# Altium schematic sheet Interface.SchDoc
size A4; SheetNumber: 8; SheetTotal: 11
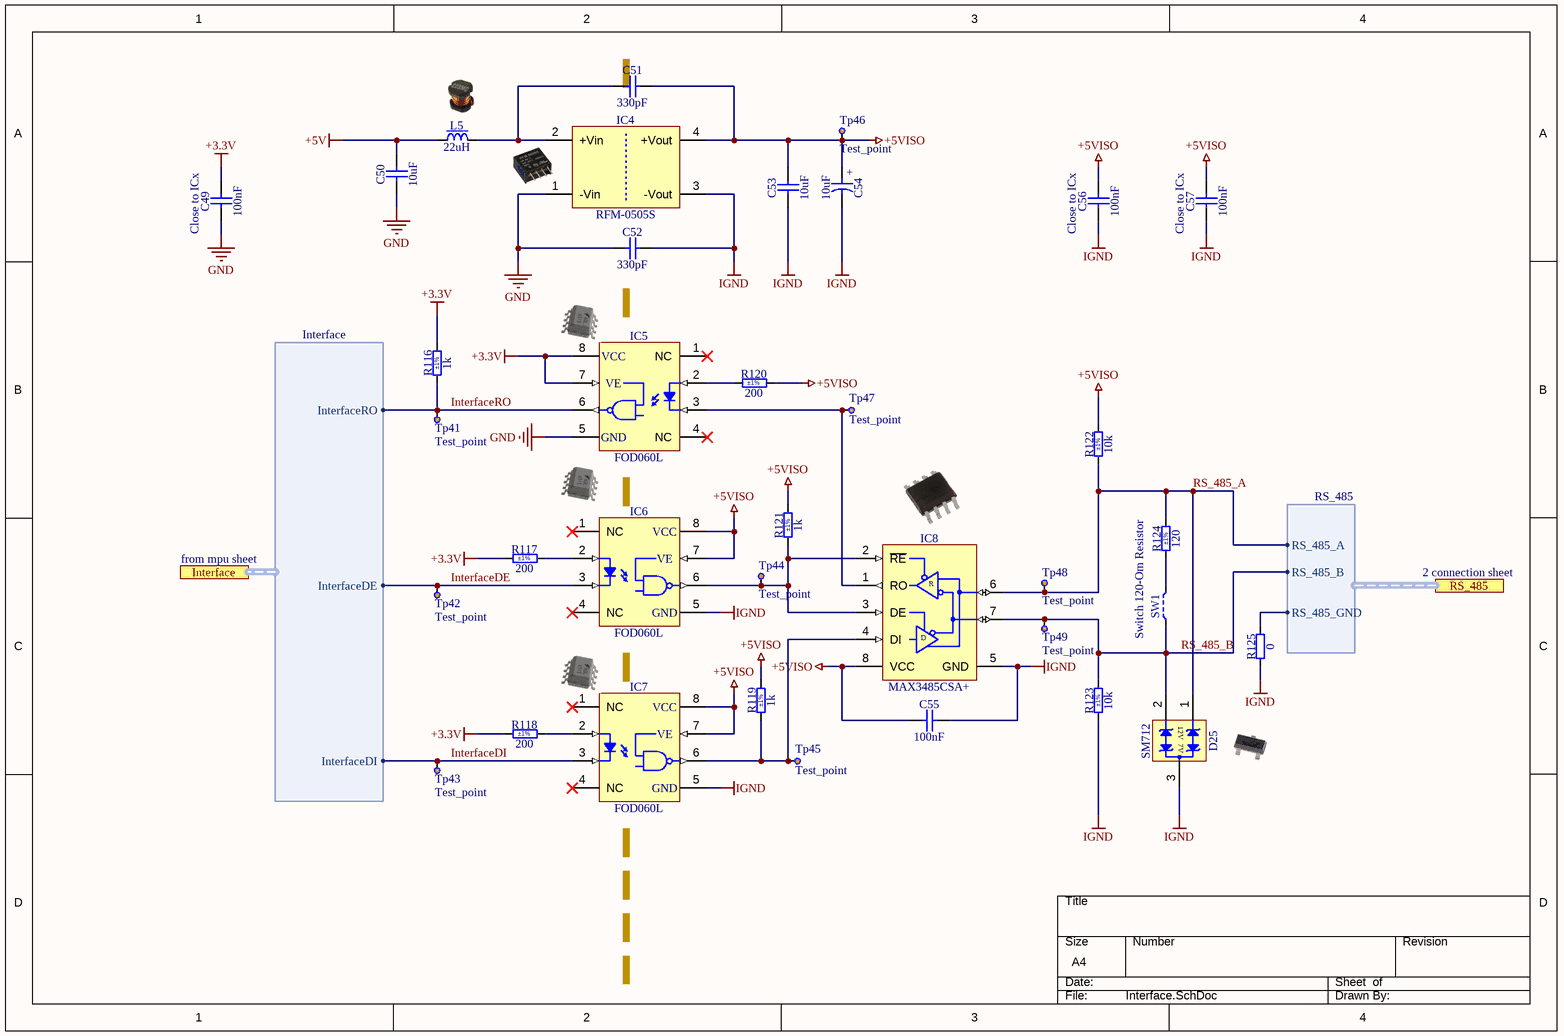
[diagram p0: Interface.SchDoc]

## Parts
C49  100nF  [CAPC1608X87N]
C50  10uF  [CAPC3216X140N]
C51  330pF  [CAPC4620X220N]
C52  330pF  [CAPC4620X220N]
C53  10uF  [CAPC3216X140N]
C54  10uF  [CAPAE430X540N]
C55  100nF  [CAPC1608X87N]
C56  100nF  [CAPC1608X87N]
C57  100nF  [CAPC1608X87N]
D25  SM712  [SOT95P237X112-3N]
IC4  RFM-0505S  [DCDC_RECOM_RFM]
IC5  FOD060L  [SOIC127P594X363-8N]
IC6  FOD060L  [SOIC127P594X363-8N]
IC7  FOD060L  [SOIC127P594X363-8N]
IC8  MAX3485CSA+  [SOIC127P600X175-8N]
L5  22uH  [IND_MURATA-PS_8200]
R116  1k  Tolerance: ±1%  [RESC1608X55N]
R117  200  Tolerance: ±1%  [RESC1608X55N]
R118  200  Tolerance: ±1%  [RESC1608X55N]
R119  1k  Tolerance: ±1%  [RESC1608X55N]
R120  200  Tolerance: ±1%  [RESC1608X55N]
R121  1k  Tolerance: ±1%  [RESC1608X55N]
R122  10k  Tolerance: ±1%  [RESC1608X55N]
R123  10k  Tolerance: ±1%  [RESC1608X55N]
R124  120  Tolerance: ±1%  [RESC3216X65N]
R125  0  [RESC1608X55N]
SW1  Switch  [JUMPSMD0805_G50]  (value not drawn)  (no BOM)
Tp41  Test_point  [TP_C40]
Tp42  Test_point  [TP_C40]
Tp43  Test_point  [TP_C40]
Tp44  Test_point  [TP_C40]
Tp45  Test_point  [TP_C40]
Tp46  Test_point  [TP_C40]
Tp47  Test_point  [TP_C40]
Tp48  Test_point  [TP_C40]
Tp49  Test_point  [TP_C40]

## Ports
Interface (harness Interface), RS_485 (harness RS_485)

## Harnesses
RS_485: RS_485_A, RS_485_B, RS_485_GND
Interface: InterfaceRO, InterfaceDE, InterfaceDI

## Nets
+3.3V: C49.2 IC5.7(VE) IC5.8(VCC) R116.2 R117.1 R118.1
+5V: C50.2 L5.1
+5VISO: C51.2 C53.2 C54.1 C55.1 C56.2 C57.2 IC4.4(+Vout) IC6.7(VE) IC6.8(VCC) IC7.7(VE) IC7.8(VCC) IC8.8(VCC) R119.2 R120.2 R121.2 R122.2 Tp46.1
GND: C49.1 C50.1 C52.1 IC4.1(-Vin) IC5.5(GND)
IGND: C52.2 C53.1 C54.2 C55.2 C56.1 C57.1 D25.3(GND) IC4.3(-Vout) IC6.5(GND) IC7.5(GND) IC8.5(GND) R123.1 R125.1
InterfaceDE: IC6.3(K) Tp42.1 ; port Interface.InterfaceDE
InterfaceDI: IC7.3(K) Tp43.1 ; port Interface.InterfaceDI
InterfaceRO: IC5.6(VO) R116.1 Tp41.1 ; port Interface.InterfaceRO
RS_485_A: D25.1(I/O1) IC8.6(A) R122.1 R124.2 Tp48.1 ; port RS_485.RS_485_A
RS_485_B: D25.2(I/O2) IC8.7(B) R123.2 SW1.1 Tp49.1 ; port RS_485.RS_485_B
NetC51_1: C51.1 IC4.2(+Vin) L5.2
NetIC5_2: IC5.2(A) R120.1
NetIC5_3: IC5.3(K) IC8.1(RO) Tp47.1
NetIC6_2: IC6.2(A) R117.2
NetIC6_6: IC6.6(VO) IC8.2(~{RE}) IC8.3(DE) R121.1 Tp44.1
NetIC7_2: IC7.2(A) R118.2
NetIC7_6: IC7.6(VO) IC8.4(DI) R119.1 Tp45.1
NetR124_1: R124.1 SW1.2
NetR125_2: R125.2 ; port RS_485.RS_485_GND

Not connected (* = marked no-connect by the designer): IC5 1(NC)* 4(NC)*; IC6 1(NC)* 4(NC)*; IC7 1(NC)* 4(NC)*

## Notes on the sheet
- (near C49) Close to ICx
- (near C56) Close to ICx
- (near C57) Close to ICx
- from mpu sheet
- 2 connection sheet
- Switch 120-Om Resistor
- THIS DOCUMENT AND THE DATA DISCLOSED HEREIN OR
- HEREWITH IS THE PROPERTY OF ALTIUM LIMITED AND MAY
- DWG NO:
- REVISION
- REV:
- DESCRIPTION
- DATE
- APPROVED
- BE FREELY DISTRIBUTED IN WHOLE. NO RIGHTS ARE
- RESERVED OR EXPRESS OR IMPLIED WARANTEE GIVEN.
- ENG:
- APPROVALS
- PROJECT
- DSN:
- CHK:
- REFERENCE DOCUMENTS
- PROJECT REVISION:
- TITLE
- DOCUMENT REVISION:
- DESIGN ITEM:
- BOM:
- FAB DWG:
- PCB DWG:
- ASSY DWG:
- SCALE:
- A3
- SIZE
- CAGE CODE
- FILE NAME
- DWG NO.
- SHEET
- OF
- REV
- (in symbol CAE430-540_10UF_16V_20%) +
- (in symbol MAX3485CSA+) R; D
- (in symbol SM712) 12V; 7V

## Library data of the parts
C49 C55-C57 = CC0603_100NF_50V_10%_X7R: Non-polarised capacitor; Part Description: SMD Multilayer Chip Ceramic Capacitor; Manufacturer: GENERIC; Manufacturer1 Part Number: 223858615649; Voltage: 50V; TC: X7R; Tolerance: ±10%; Part Number: CC0603_100NF_50V_10%_X7R; Component Kind: Standard; Component Type: Standard; Pin Count: 2; Value: 100nF; Status: Preferred; Manufacturer Part Number: CC0603_100NF_50V_10%_X7R; Case: 0603; Mounted: Yes; Socket: No; SMD: Yes; Sense: No; Manufacturer1 Example: PHYCOMP; Manufacturer1 ComponentHeight: 0.87mm; HelpURL: \\cern.ch\dfs\Applications\Altium\Datasheets\CC0603_X7R_PHYCOMP.pdf; Author: CERN DEM JLC; CreateDate: 03.12.2007; LatestRevisionDate: 03.12.2007
C50 C53 = CC1206_10UF_16V_10%_X7R: Non-polarised capacitor; Part Description: SMD Multilayer Chip Ceramic Capacitor; Manufacturer: GENERIC; Manufacturer1 Part Number: C1206C106K4RAC; Voltage: 16V; TC: X7R; Tolerance: ±10%; Part Number: CC1206_10UF_16V_10%_X7R; Component Kind: Standard; Component Type: Standard; Pin Count: 2; Value: 10uF; Status: Preferred; Manufacturer Part Number: CC1206_10UF_16V_10%_X7R; Case: 1206; Mounted: Yes; Socket: No; SMD: Yes; Sense: No; Manufacturer1 Example: KEMET; Manufacturer1 ComponentHeight: 1.8mm; HelpURL: \\cern.ch\dfs\Applications\Altium\Datasheets\CC1206_X7R_KEMET.pdf; Author: CERN DEM JLC; CreateDate: 28.04.2009; LatestRevisionDate: 28.04.2009
C51 C52 = CC1808_330PF_3KV_10%_X7R: Non-polarised capacitor; Part Description: High Voltage MLC Chip Capacitor; Manufacturer: GENERIC; Manufacturer1 Part Number: 1808HC331KAT1A; Voltage: 3kV; TC: X7R; Tolerance: ±10%; Part Number: CC1808_330PF_3KV_10%_X7R; Component Kind: Standard; Component Type: Standard; Pin Count: 2; Value: 330pF; Status: None; Manufacturer Part Number: CC1808_330PF_3KV_10%_X7R; Case: 1808; Mounted: Yes; Socket: No; SMD: Yes; Sense: No; Manufacturer1 Example: AVX; Manufacturer1 ComponentHeight: 2.20mm; HelpURL: \\cern.ch\dfs\Applications\Altium\Datasheets\CC1808_X7R_AVX_HV-MLC.pdf; Author: CERN DEM MR; CreateDate: 16.11.2017; LatestRevisionDate: 16.11.2017
C54 = CAE430-540_10UF_16V_20%: Polarised capacitor; Part Description: Aluminum Electrolytic SMT Capacitor; Manufacturer: PANASONIC; Manufacturer Part Number: EEEFK1C100AR; Voltage: 16V; Tolerance: ±20%; Part Number: CAE430-540_10UF_16V_20%; Component Kind: Standard; Component Type: Standard; Pin Count: 2; Value: 10uF; Status: Not Recommended; Case: B; Mounted: Yes; Socket: No; SMD: Yes; Sense: No; ComponentHeight: 5.8mm; HelpURL: \\cern.ch\dfs\Applications\Altium\Datasheets\CAE_PANASONIC_FK-V.pdf; Author: CERN DEM JLC; CreateDate: 03.12.2007; LatestRevisionDate: 05.11.2014
D25 = SM712: Asymmetrical TVS Diode for Extended Common-Mode RS-485; Manufacturer: SEMTECH; Voltage: 12V/-7V; Power: 400W; PressFit: No; Bonding: No; Part Number: SM712; Component Kind: Standard; Component Type: Standard; Device: SM712; PackageDescription: SOT, 0.95mm Pitch; 3 Pin, 1.30mm W X 2.92mm L X 1.12mm H body, IPC Medium Density; Status: Obsolete; Part Description: Asymmetrical TVS Diode for Extended Common-Mode RS-485; Manufacturer Part Number: SM712; Pin Count: 3; Case: SOT23-3; Mounted: Yes; Socket: No; SMD: Yes; Sense: No; ComponentHeight: 1.12mm; HelpURL: \\cern.ch\dfs\Applications\Altium\Datasheets\SM712.pdf; Author: CERN DEM JLC; CreateDate: 23.04.2012; LatestRevisionDate: 23.04.2012
IC4 = RFM-0505S: RECOM, RFM Serie, Single Output DCDC Converter; Part Description: 5V ±10% to 5V, Iout (max) 200mA, 1W DC-DC Converter; PressFit: No; Bonding: No; Part Number: RFM-0505S; Component Kind: Standard; Component Type: Standard; Device: RFM-0505S; PackageDescription: RFM Series, Body 11.5x6.00mm, SIP-4 Package; Manufacturer: RECOM; Manufacturer Part Number: RFM-0505S; Pin Count: 4; Mounted: Yes; Socket: No; SMD: No; Sense: No; ComponentHeight: 10.5mm; HelpURL: \\cern.ch\dfs\Applications\Altium\Datasheets\RFM-0505S.pdf; Author: CERN DEM BC; CreateDate: 16.07.2020; LatestRevisionDate: 16.07.2020
IC5-IC7 = FOD060L: Single Optocoupler; Part Description: LVTTL/LVCMOS 3.3V High Speed-10 MBit/s Logic Gate Optocoupler; Manufacturer: FAIRCHILD SEMICONDUCTOR; PressFit: No; Bonding: No; Part Number: FOD060L; Component Kind: Standard; Component Type: Standard; Device: FOD060L; PackageDescription: SOIC, 1.27mm Pitch; 8 Pin, 3.91mm W X 4.88mm L X 3.63mm H body, IPC Medium Density; Manufacturer Part Number: FOD060L; Pin Count: 8; Case: SOIC8; Mounted: Yes; Socket: No; SMD: Yes; Sense: No; ComponentHeight: 3.63mm; HelpURL: \\cern.ch\dfs\Applications\Altium\Datasheets\FOD060L.pdf; Author: CERN DEM JLC; CreateDate: 05.10.2011; LatestRevisionDate: 05.10.2011
IC8 = MAX3485CSA+: 3.3V-Powered, ±15kV ESD-Protected, 10Mbps,True RS-485/RS-422 Half Duplex Transceiver; Manufacturer: MAXIM; PressFit: No; Bonding: No; Part Number: MAX3485CSA+; Component Kind: Standard; Component Type: Standard; Device: MAX3485CSA+; PackageDescription: SOIC, 1.27mm Pitch; 8 Pin - Body 4x5mm, IPC Medium Density; Part Description: 3.3V-Powered, ±15kV ESD-Protected, 10Mbps,True RS-485/RS-422 Half Duplex Transceiver; Manufacturer Part Number: MAX3485CSA+; Pin Count: 8; Case: SOIC8; Mounted: Yes; Socket: No; SMD: Yes; Sense: No; ComponentHeight: 1.75mm; HelpURL: \\cern.ch\dfs\Applications\Altium\Datasheets\MAX3485CSA+.pdf; Author: CERN DEM JLC; CreateDate: 05.10.2009; LatestRevisionDate: 05.10.2009
L5 = IND_22UH_10%_MURATA-PS_8200: Inductor With Core; Part Description: Miniature Surface Mount Power Inductor (8200 Series); Manufacturer: MURATA POWER SOLUTIONS; Manufacturer Part Number: 82223C; Power: 320mA; Resistance: 0.92R; Tolerance: ±10%; Part Number: IND_22UH_10%_MURATA-PS_8200; Component Kind: Standard; Component Type: Standard; Pin Count: 2; Value: 22uH; Mounted: Yes; Socket: No; SMD: Yes; Sense: No; ComponentHeight: 2.3mm; HelpURL: \\cern.ch\dfs\Applications\Altium\Datasheets\IND_MURATA-PS_8200.pdf; Author: CERN DEM JMW; CreateDate: 07.10.2015; LatestRevisionDate: 07.10.2015
R116 R119 R121 = R0603_1K_1%_0.1W_100PPM: Resistor - 1%; Part Description: General Purpose Thick Film Chip Resistor; Manufacturer: GENERIC; Manufacturer1 Part Number: NRC06F1001TRF; Power: 0.1W; TC: ±100ppm/°C; PressFit: No; Part Number: R0603_1K_1%_0.1W_100PPM; Component Kind: Standard; Component Type: Standard; Pin Count: 2; Value: 1k; Status: Preferred; Manufacturer Part Number: R0603_1K_1%_0.1W_100PPM; Case: 0603; Mounted: Yes; Sense: No; Socket: No; SMD: Yes; Manufacturer1 Example: NIC COMPONENT; Manufacturer1 ComponentHeight: 0.55mm; HelpURL: \\cern.ch\dfs\Applications\Altium\Datasheets\R0603_NIC_NRC.pdf; Author: CERN DEM JLC; CreateDate: 03.12.2007; LatestRevisionDate: 13.03.2008
R117 R118 R120 = R0603_200R_1%_0.1W_100PPM: Resistor - 1%; Part Description: General Purpose Thick Film Chip Resistor; Manufacturer: GENERIC; Manufacturer1 Part Number: NRC06F2000TRF; Power: 0.1W; TC: ±100ppm/°C; PressFit: No; Part Number: R0603_200R_1%_0.1W_100PPM; Component Kind: Standard; Component Type: Standard; Pin Count: 2; Value: 200; Status: Preferred; Manufacturer Part Number: R0603_200R_1%_0.1W_100PPM; Case: 0603; Mounted: Yes; Sense: No; Socket: No; SMD: Yes; Manufacturer1 Example: NIC COMPONENT; Manufacturer1 ComponentHeight: 0.55mm; HelpURL: \\cern.ch\dfs\Applications\Altium\Datasheets\R0603_NIC_NRC.pdf; Author: CERN DEM JLC; CreateDate: 03.12.2007; LatestRevisionDate: 13.03.2008
R122 R123 = R0603_10K_1%_0.1W_100PPM: Resistor - 1%; Part Description: General Purpose Thick Film Chip Resistor; Manufacturer: GENERIC; Manufacturer1 Part Number: NRC06F1002TRF; Power: 0.1W; TC: ±100ppm/°C; PressFit: No; Part Number: R0603_10K_1%_0.1W_100PPM; Component Kind: Standard; Component Type: Standard; Pin Count: 2; Value: 10k; Status: Preferred; Manufacturer Part Number: R0603_10K_1%_0.1W_100PPM; Case: 0603; Mounted: Yes; Sense: No; Socket: No; SMD: Yes; Manufacturer1 Example: NIC COMPONENT; Manufacturer1 ComponentHeight: 0.55mm; HelpURL: \\cern.ch\dfs\Applications\Altium\Datasheets\R0603_NIC_NRC.pdf; Author: CERN DEM JLC; CreateDate: 03.12.2007; LatestRevisionDate: 13.03.2008
R124 = R1206_120R_1%_0.25W_100PPM: Resistor - 1%; Part Description: General Purpose Thick Film Chip Resistor; Manufacturer: GENERIC; Manufacturer1 Part Number: NRC12F1200TRF; Power: 0.25W; TC: ±100ppm/°C; PressFit: No; Part Number: R1206_120R_1%_0.25W_100PPM; Component Kind: Standard; Component Type: Standard; Pin Count: 2; Value: 120; Status: Preferred; Manufacturer Part Number: R1206_120R_1%_0.25W_100PPM; Case: 1206; Mounted: Yes; Sense: No; Socket: No; SMD: Yes; Manufacturer1 Example: NIC COMPONENT; Manufacturer1 ComponentHeight: 0.65mm; HelpURL: \\cern.ch\dfs\Applications\Altium\Datasheets\R1206_NIC_NRC.pdf; Author: CERN DEM JLC; CreateDate: 03.12.2007; LatestRevisionDate: 13.03.2008
R125 = R0603_0R_JUMPER: Resistor; Part Description: 1A (0.05R Max DC Resistance) Zero Ohm Jumper; Manufacturer: GENERIC; Manufacturer1 Part Number: NRC06Z0; PressFit: No; Part Number: R0603_0R_JUMPER; Component Kind: Standard; Component Type: Standard; Pin Count: 2; Value: 0; Status: Preferred; Manufacturer Part Number: R0603_0R_JUMPER; Case: 0603; Mounted: Yes; Sense: No; Socket: No; SMD: Yes; Manufacturer1 Example: NIC COMPONENT; Manufacturer1 ComponentHeight: 0.55mm; HelpURL: \\cern.ch\dfs\Applications\Altium\Datasheets\R0603_NIC_NRC.pdf; Author: CERN DEM JLC; CreateDate: 03.12.2007; LatestRevisionDate: 13.03.2008
SW1 = JUMPSMD0805_G50: 2 SMD Pads for Bound by Solder  Drop; Part Description: 2 SMD Pads for Bound by Solder Drop - Equivalent Size 0805 - Gap 0.5mm; Manufacturer: None; Mounted: No; PressFit: No; Part Number: JUMPSMD0805_G50; Component Type: Standard (No BOM); Pin Count: 2; PackageDescription: 2 SMD Pads for Bound by Solder Drop - Equivalent Size 0805 - Gap 0.5mm; Family: Switch; Socket: No; SMD: No; Sense: No; Status: None; Manufacturer Part Number: None; ComponentHeight: 0mm; HelpURL: None; Author: CERN DEM JLC; CreateDate: 26.08.2009; LatestRevisionDate: 12.02.2021
Tp41-Tp49 = Test point: Published: 8-Jun-2000; LatestRevisionDate: 17-Jul-2002; LatestRevisionNote: Re-released for DXP Platform.; PackageReference: AXIAL-0.3; Publisher: Altium Limited